# Altium schematic sheet QCopterFC_PWM_Sch.SchDoc
size A4
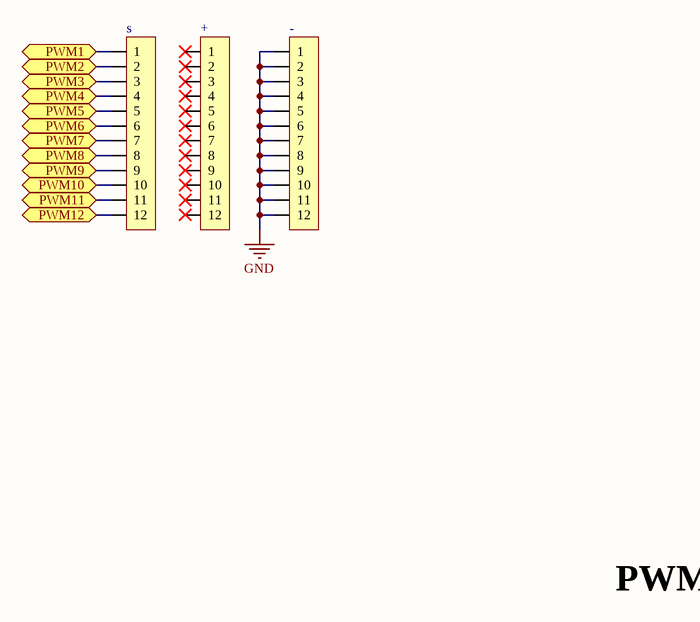
[diagram p0: QCopterFC_PWM_Sch.SchDoc]

## Parts
+  HDR1X12_180_2.54  [HDR1X12_180_2.54]  (value not drawn)
-  HDR1X12_180_2.54  [HDR1X12_180_2.54]  (value not drawn)
s  HDR1X12_180_2.54  [HDR1X12_180_2.54]  (value not drawn)

## Ports
PWM1, PWM2, PWM3, PWM4, PWM5, PWM6, PWM7, PWM8, PWM9, PWM10, PWM11, PWM12

## Nets
GND: -.1 -.2 -.3 -.4 -.5 -.6 -.7 -.8 -.9 -.10 -.11 -.12
PWM1: s.1 ; port PWM1
PWM2: s.2 ; port PWM2
PWM3: s.3 ; port PWM3
PWM4: s.4 ; port PWM4
PWM5: s.5 ; port PWM5
PWM6: s.6 ; port PWM6
PWM7: s.7 ; port PWM7
PWM8: s.8 ; port PWM8
PWM9: s.9 ; port PWM9
PWM10: s.10 ; port PWM10
PWM11: s.11 ; port PWM11
PWM12: s.12 ; port PWM12

Not connected (* = marked no-connect by the designer): + 1* 2* 3* 4* 5* 6* 7* 8* 9* 10* 11* 12*

## Notes on the sheet
- PWM

## Library data of the parts
+ - s = HDR1X12_180_2.54: Header